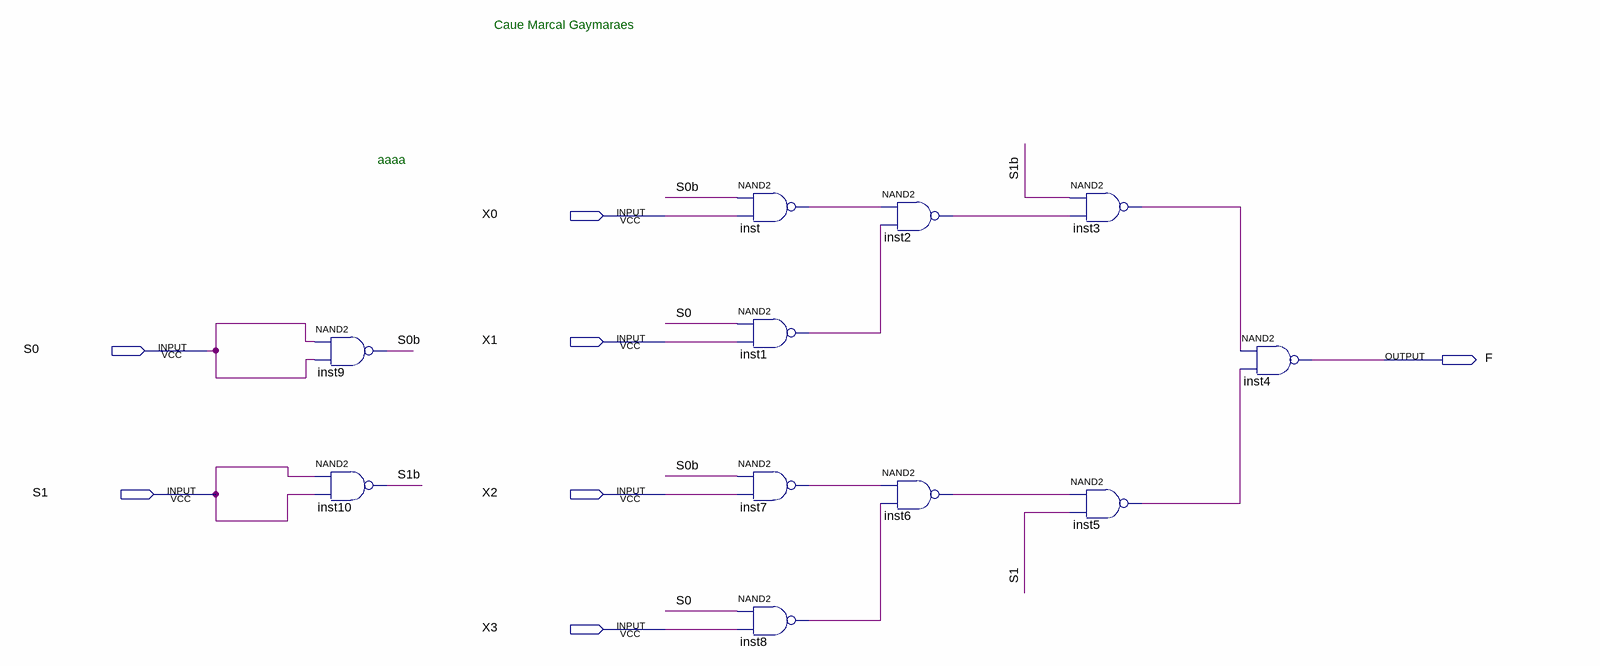
[diagram p0: schematic sheet]
// Quartus schematic q4.bdf as structural Verilog: 11 symbols, 7 pins
module q4 (
  input  X0,
  input  X1,
  input  S0,
  input  S1,
  input  X2,
  input  X3,
  output F
);

  wire inst1_out, inst2_out, inst3_out, inst5_out, inst6_out, inst7_out, inst8_out, inst_out, S0b, S1b;

  nand inst9 (S0b, S0, S0);
  nand inst10 (S1b, S1, S1);
  nand inst (inst_out, S0b, X0);
  nand inst1 (inst1_out, S0, X1);
  nand inst7 (inst7_out, S0b, X2);
  nand inst8 (inst8_out, S0, X3);
  nand inst2 (inst2_out, inst_out, inst1_out);
  nand inst6 (inst6_out, inst7_out, inst8_out);
  nand inst3 (inst3_out, S1b, inst2_out);
  nand inst5 (inst5_out, inst6_out, S1);
  nand inst4 (F, inst3_out, inst5_out);

  // Notes on the sheet:
  //   Caue Marcal Gaymaraes  
  //   aaaa
endmodule
